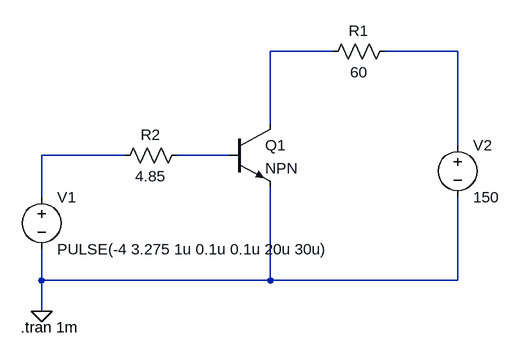
[diagram p0: schematic trans-v1.asc]
trans-v1.asc, the LTspice schematic file:
Version 4.1
SHEET 1 880 680
WIRE 224 -32 128 -32
WIRE 416 -32 304 -32
WIRE 128 80 128 -32
WIRE 416 112 416 -32
WIRE -96 128 -224 128
WIRE 64 128 -16 128
WIRE -224 192 -224 128
WIRE -224 320 -224 272
WIRE 128 320 128 176
WIRE 128 320 -224 320
WIRE 416 320 416 192
WIRE 416 320 128 320
WIRE -224 368 -224 320
FLAG -224 368 0
SYMBOL npn2 64 80 R0
SYMATTR InstName Q1
SYMBOL res 320 -48 R90
WINDOW 0 0 56 VBottom 2
WINDOW 3 32 56 VTop 2
SYMATTR InstName R1
SYMATTR Value 60
SYMBOL res 0 112 R90
WINDOW 0 0 56 VBottom 2
WINDOW 3 32 56 VTop 2
SYMATTR InstName R2
SYMATTR Value 4.85
SYMBOL voltage -224 176 R0
WINDOW 123 0 0 Left 0
WINDOW 39 0 0 Left 0
SYMATTR InstName V1
SYMATTR Value PULSE(-4 3.275 1u 0.1u 0.1u 20u 30u)
SYMBOL voltage 416 96 R0
WINDOW 123 0 0 Left 0
WINDOW 39 0 0 Left 0
SYMATTR InstName V2
SYMATTR Value 150
TEXT -256 392 Left 2 !.tran 1m

The netlist it stands for:
* trans-v1.asc
Q1 N001 N004 0 0 NPN
R1 N002 N001 60
R2 N004 N003 4.85
V1 N003 0 PULSE(-4 3.275 1u 0.1u 0.1u 20u 30u)
V2 N002 0 150
.model NPN NPN
.model PNP PNP
.lib standard.bjt
.tran 1m
.backanno
.end